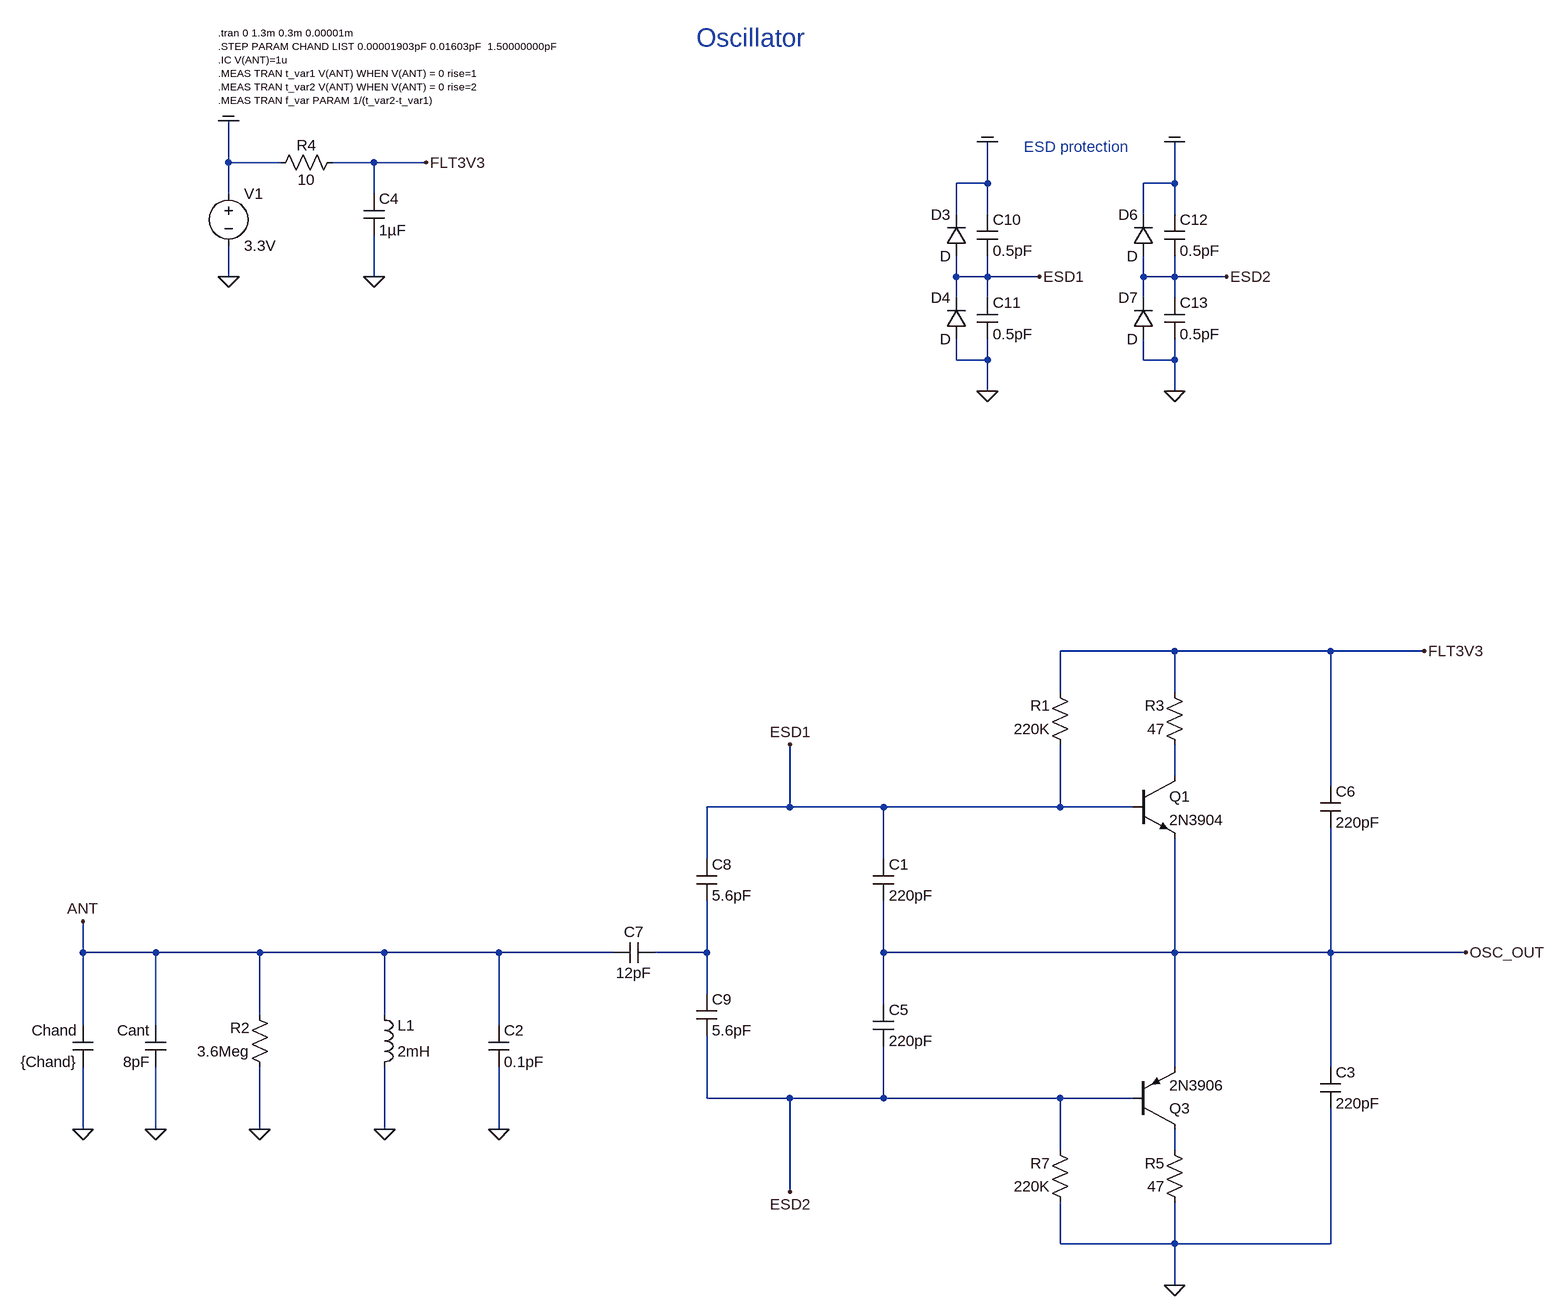
[diagram p0: schematic 2020_npn_pnp_osc_v10.asc]
2020_npn_pnp_osc_v10.asc, the LTspice schematic file:
Version 4
SHEET 1 2908 2724
WIRE -1056 -336 -1056 -400
WIRE -976 -336 -1056 -336
WIRE -832 -336 -896 -336
WIRE -752 -336 -832 -336
WIRE 112 -304 112 -368
WIRE 112 -304 64 -304
WIRE 400 -304 400 -368
WIRE 400 -304 352 -304
WIRE -1056 -288 -1056 -336
WIRE -832 -288 -832 -336
WIRE 64 -256 64 -304
WIRE 112 -256 112 -304
WIRE 352 -256 352 -304
WIRE 400 -256 400 -304
WIRE -1056 -160 -1056 -208
WIRE -832 -160 -832 -224
WIRE 64 -160 64 -192
WIRE 112 -160 112 -192
WIRE 112 -160 64 -160
WIRE 192 -160 112 -160
WIRE 352 -160 352 -192
WIRE 400 -160 400 -192
WIRE 400 -160 352 -160
WIRE 480 -160 400 -160
WIRE 64 -128 64 -160
WIRE 112 -128 112 -160
WIRE 352 -128 352 -160
WIRE 400 -128 400 -160
WIRE 64 -32 64 -64
WIRE 112 -32 112 -64
WIRE 112 -32 64 -32
WIRE 352 -32 352 -64
WIRE 400 -32 400 -64
WIRE 400 -32 352 -32
WIRE 112 16 112 -32
WIRE 400 16 400 -32
WIRE 400 416 224 416
WIRE 640 416 400 416
WIRE 784 416 640 416
WIRE 224 480 224 416
WIRE 400 480 400 416
WIRE 400 608 400 560
WIRE 640 624 640 416
WIRE -192 656 -192 560
WIRE -192 656 -320 656
WIRE -48 656 -192 656
WIRE 224 656 224 560
WIRE 224 656 -48 656
WIRE 336 656 224 656
WIRE -320 736 -320 656
WIRE -48 736 -48 656
WIRE -1280 880 -1280 832
WIRE -1168 880 -1280 880
WIRE -1008 880 -1168 880
WIRE -816 880 -1008 880
WIRE -640 880 -816 880
WIRE -464 880 -640 880
WIRE -320 880 -320 800
WIRE -320 880 -400 880
WIRE -48 880 -48 800
WIRE 400 880 400 704
WIRE 400 880 -48 880
WIRE 640 880 640 688
WIRE 640 880 400 880
WIRE 848 880 640 880
WIRE -320 944 -320 880
WIRE -48 960 -48 880
WIRE -1008 976 -1008 880
WIRE -816 976 -816 880
WIRE -1280 992 -1280 880
WIRE -1168 992 -1168 880
WIRE -640 992 -640 880
WIRE 400 1056 400 880
WIRE 640 1056 640 880
WIRE -320 1104 -320 1008
WIRE -192 1104 -320 1104
WIRE -48 1104 -48 1024
WIRE -48 1104 -192 1104
WIRE 224 1104 -48 1104
WIRE 336 1104 224 1104
WIRE -1280 1152 -1280 1056
WIRE -1168 1152 -1168 1056
WIRE -1008 1152 -1008 1056
WIRE -816 1152 -816 1056
WIRE -640 1152 -640 1056
WIRE 224 1184 224 1104
WIRE 400 1184 400 1152
WIRE -192 1248 -192 1104
WIRE 224 1328 224 1264
WIRE 400 1328 400 1264
WIRE 400 1328 224 1328
WIRE 640 1328 640 1120
WIRE 640 1328 400 1328
WIRE 400 1392 400 1328
FLAG -1056 -160 0
FLAG -1280 1152 0
FLAG -1280 832 ANT
FLAG -1056 -400 COM
FLAG 112 16 0
FLAG 112 -368 COM
FLAG 192 -160 ESD1
FLAG 400 16 0
FLAG 400 -368 COM
FLAG 480 -160 ESD2
FLAG -1168 1152 0
FLAG -192 560 ESD1
FLAG -832 -160 0
FLAG -1008 1152 0
FLAG -816 1152 0
FLAG -752 -336 FLT3V3
FLAG 784 416 FLT3V3
FLAG 848 880 OSC_OUT
FLAG -192 1248 ESD2
FLAG 400 1392 0
FLAG -640 1152 0
SYMBOL voltage -1056 -304 R0
WINDOW 123 0 0 Left 2
WINDOW 39 0 0 Left 2
SYMATTR InstName V1
SYMATTR Value 3.3V
SYMBOL ind -832 1072 M180
WINDOW 0 36 80 Left 2
WINDOW 3 36 40 Left 2
SYMATTR InstName L1
SYMATTR Value 2mH
SYMATTR SpiceLine Ipk=0.1 Rser=36 Rpar=10Meg Cpar=1.286pF
SYMBOL cap -1264 992 M0
SYMATTR InstName Chand
SYMATTR Value {Chand}
SYMBOL diode 80 -192 R180
WINDOW 0 24 64 Left 2
WINDOW 3 24 0 Left 2
SYMATTR InstName D3
SYMBOL diode 80 -64 R180
WINDOW 0 24 64 Left 2
WINDOW 3 24 0 Left 2
SYMATTR InstName D4
SYMBOL cap 96 -256 R0
SYMATTR InstName C10
SYMATTR Value 0.5pF
SYMBOL cap 96 -128 R0
SYMATTR InstName C11
SYMATTR Value 0.5pF
SYMBOL diode 368 -192 R180
WINDOW 0 24 64 Left 2
WINDOW 3 24 0 Left 2
SYMATTR InstName D6
SYMBOL diode 368 -64 R180
WINDOW 0 24 64 Left 2
WINDOW 3 24 0 Left 2
SYMATTR InstName D7
SYMBOL cap 384 -256 R0
SYMATTR InstName C12
SYMATTR Value 0.5pF
SYMBOL cap 384 -128 R0
SYMATTR InstName C13
SYMATTR Value 0.5pF
SYMBOL cap -1152 992 M0
SYMATTR InstName Cant
SYMATTR Value 8pF
SYMBOL res -880 -352 R90
WINDOW 0 5 56 VBottom 2
WINDOW 3 27 56 VTop 2
SYMATTR InstName R4
SYMATTR Value 10
SYMBOL cap -848 -288 R0
SYMATTR InstName C4
SYMATTR Value 1µF
SYMBOL res 240 576 R180
WINDOW 0 31 76 Left 2
WINDOW 3 31 40 Left 2
SYMATTR InstName R1
SYMATTR Value 220K
SYMBOL res -992 1072 R180
WINDOW 0 31 76 Left 2
WINDOW 3 31 40 Left 2
SYMATTR InstName R2
SYMATTR Value 3.6Meg
SYMBOL cap -64 736 R0
SYMATTR InstName C1
SYMATTR Value 220pF
SYMBOL cap 624 1056 R0
SYMATTR InstName C3
SYMATTR Value 220pF
SYMBOL npn 336 608 R0
SYMATTR InstName Q1
SYMATTR Value 2N3904
SYMBOL pnp 336 1152 M180
SYMATTR InstName Q3
SYMATTR Value 2N3906
SYMBOL res 240 1280 R180
WINDOW 0 31 76 Left 2
WINDOW 3 31 40 Left 2
SYMATTR InstName R7
SYMATTR Value 220K
SYMBOL cap -64 960 R0
SYMATTR InstName C5
SYMATTR Value 220pF
SYMBOL cap 624 624 R0
SYMATTR InstName C6
SYMATTR Value 220pF
SYMBOL cap -400 864 R90
WINDOW 0 0 32 VBottom 2
WINDOW 3 32 32 VTop 2
SYMATTR InstName C7
SYMATTR Value 12pF
SYMBOL cap -336 736 R0
SYMATTR InstName C8
SYMATTR Value 5.6pF
SYMBOL cap -336 944 R0
SYMATTR InstName C9
SYMATTR Value 5.6pF
SYMBOL res 416 576 R180
WINDOW 0 31 76 Left 2
WINDOW 3 31 40 Left 2
SYMATTR InstName R3
SYMATTR Value 47
SYMBOL res 416 1280 R180
WINDOW 0 31 76 Left 2
WINDOW 3 31 40 Left 2
SYMATTR InstName R5
SYMATTR Value 47
SYMBOL cap -656 992 R0
SYMATTR InstName C2
SYMATTR Value 0.1pF
TEXT -1072 -536 Left 1 !.tran 0 1.3m 0.3m 0.00001m\n.STEP PARAM CHAND LIST 0.00001903pF 0.01603pF  1.50000000pF\n.IC V(ANT)=1u\n.MEAS TRAN t_var1 V(ANT) WHEN V(ANT) = 0 rise=1\n.MEAS TRAN t_var2 V(ANT) WHEN V(ANT) = 0 rise=2\n.MEAS TRAN f_var PARAM 1/(t_var2-t_var1)
TEXT 168 -360 Left 2 ;ESD protection
TEXT -336 -528 Left 4 ;Oscillator

The netlist it stands for:
* 2020_npn_pnp_osc_v10.asc
V1 COM 0 3.3V
L1 0 ANT 2mH Ipk=0.1 Rser=36 Rpar=10Meg Cpar=1.286pF
Chand ANT 0 {Chand}
D3 ESD1 COM D
D4 0 ESD1 D
C10 COM ESD1 0.5pF
C11 ESD1 0 0.5pF
D6 ESD2 COM D
D7 0 ESD2 D
C12 COM ESD2 0.5pF
C13 ESD2 0 0.5pF
Cant ANT 0 8pF
R4 FLT3V3 COM 10
C4 FLT3V3 0 1µF
R1 ESD1 FLT3V3 220K
R2 0 ANT 3.6Meg
C1 ESD1 OSC_OUT 220pF
C3 OSC_OUT 0 220pF
Q1 N001 ESD1 OSC_OUT 0 2N3904
Q3 N003 ESD2 OSC_OUT 0 2N3906
R7 0 ESD2 220K
C5 OSC_OUT ESD2 220pF
C6 FLT3V3 OSC_OUT 220pF
C7 N002 ANT 12pF
C8 ESD1 N002 5.6pF
C9 N002 ESD2 5.6pF
R3 N001 FLT3V3 47
R5 0 N003 47
C2 ANT 0 0.1pF
.model D D
.lib standard.dio
.model NPN NPN
.model PNP PNP
.lib standard.bjt
.tran 0 1.3m 0.3m 0.00001m
.STEP PARAM CHAND LIST 0.00001903pF 0.01603pF  1.50000000pF
.IC V(ANT)=1u
.MEAS TRAN t_var1 V(ANT) WHEN V(ANT) = 0 rise=1
.MEAS TRAN t_var2 V(ANT) WHEN V(ANT) = 0 rise=2
.MEAS TRAN f_var PARAM 1/(t_var2-t_var1)
* ESD protection
* Oscillator
.backanno
.end